# EAGLE design ai_breakout_LSM9DS0 (EAGLE 6.5.0)
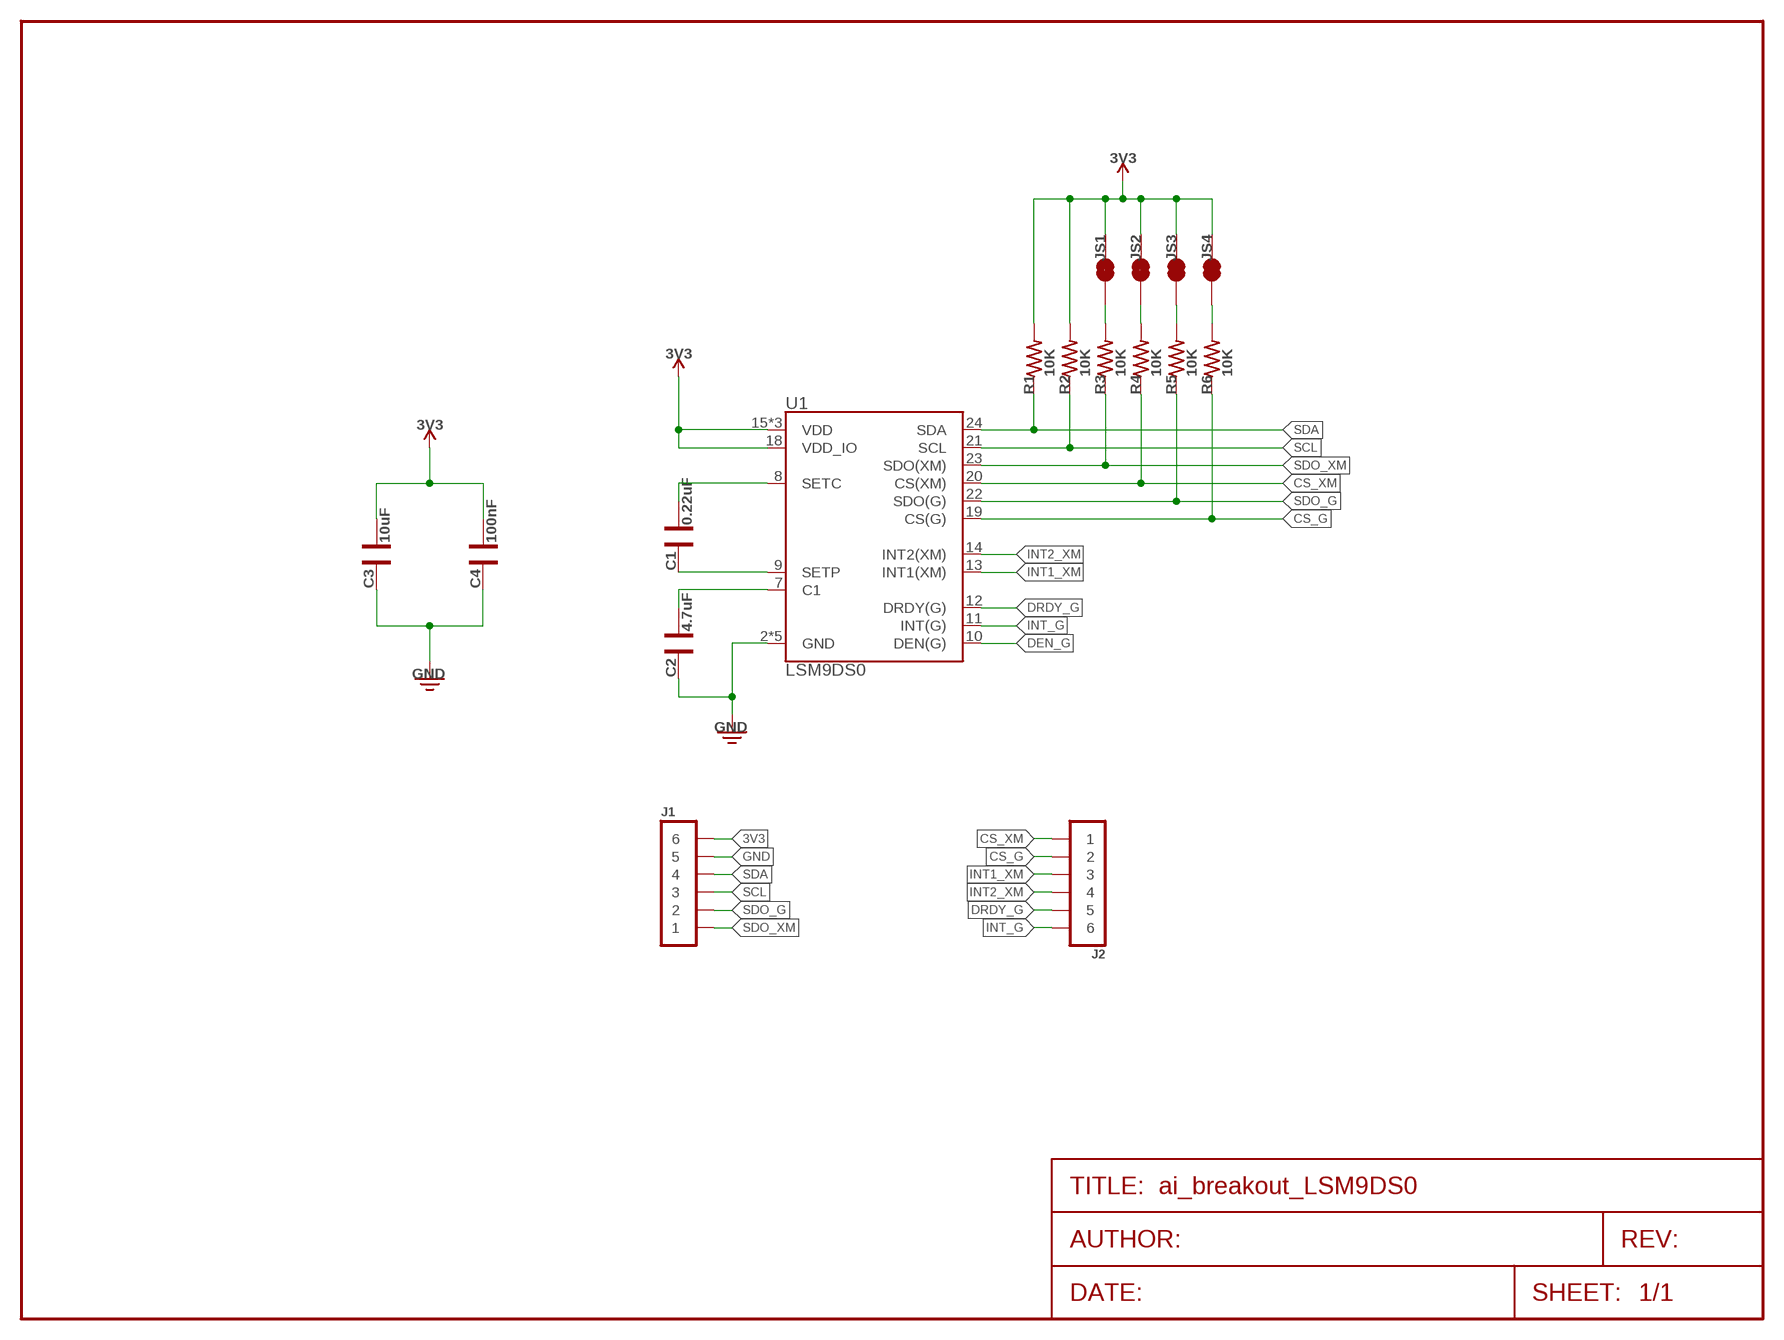
[diagram p0: schematic, sheet 1]

## Parts
C1  0.22uF  CAP0603  [CAP-0603]
C2  4.7uF  CAP0603  [CAP-0603]
C3  10uF  CAP0603  [CAP-0603]
C4  100nF  CAP0603  [CAP-0603]
J1  1X06  [1X06]
J2  1X06  [1X06]
JS1  1X02-SJ-NCT  [1X02-SJ-NCT]
JS2  1X02-SJ-NCT  [1X02-SJ-NCT]
JS3  1X02-SJ-NCT  [1X02-SJ-NCT]
JS4  1X02-SJ-NCT  [1X02-SJ-NCT]
R1  10K  RES0603  [RES-0603]
R2  10K  RES0603  [RES-0603]
R3  10K  RES0603  [RES-0603]
R4  10K  RES0603  [RES-0603]
R5  10K  RES0603  [RES-0603]
R6  10K  RES0603  [RES-0603]
U1  LSM9DS0  [LGA-24]

## Nets
3V3: C3.1 C4.1 J1.6 JS1.2 JS2.2 JS3.2 JS4.2 R1.2 R2.2 U1.15(VDD) U1.16(VDD) U1.17(VDD) U1.18(VDD_IO)
CS_G: J2.2 R6.1 U1.19(CS(G))
CS_XM: J2.1 R4.1 U1.20(CS(XM))
DEN_G: U1.10(DEN(G))
DRDY_G: J2.5 U1.12(DRDY(G))
GND: C2.2 C3.2 C4.2 J1.5 U1.2(GND) U1.3(GND) U1.4(GND) U1.5(GND) U1.6(GND)
INT1_XM: J2.3 U1.13(INT1(XM))
INT2_XM: J2.4 U1.14(INT2(XM))
INT_G: J2.6 U1.11(INT(G))
N$1: C1.1 U1.8(SETC)
N$2: C1.2 U1.9(SETP)
N$3: C2.1 U1.7(C1)
N$10: JS1.1 R3.2
N$11: JS2.1 R4.2
N$12: JS3.1 R5.2
N$13: JS4.1 R6.2
SCL: J1.3 R2.1 U1.21(SCL)
SDA: J1.4 R1.1 U1.24(SDA)
SDO_G: J1.2 R5.1 U1.22(SDO(G))
SDO_XM: J1.1 R3.1 U1.23(SDO(XM))

## Library data of the parts
C1-C4 = Ai_Passives:CAP
J1 J2 = Ai_Connectors:1X06
JS1-JS4 = Ai_Connectors:1X02-SJ-NC: Solder Jumper Normally closed versions.
R1-R6 = Ai_Passives:RES: Part # blah Digikey
U1 = SparkFun-DigitalIC:LSM9DS0: LSM9DS0 3D Accelerometer, 3D Gyroscope, 3D Magnetomter Features: 3 acceleration channels, 3 angular rate channels, 3 magnetic field channels ±2/±4/±6/±8/±16 g linear acceleration full scale ±2/±4/±8/±12 gauss magnetic full scale ±245/±500/±2000 dps angular rate full scale 16-bit data output SPI / I2C serial interfaces Analog supply voltage 2.4 V to 3.6 V Power-down mode / low-power mode Programmable interrupt generators Embedded self-test Embedded temperature sensor Embedded FIFO Position and motion detection functions Click/double-click recognition

## Net classes
0 default: width 0.203 mm, drill 0.381 mm, clearance 0.152 mm

## Board
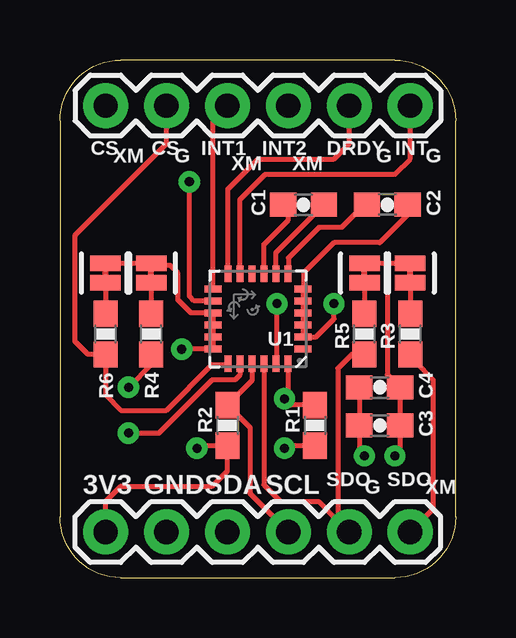
[diagram p1: board, top side]
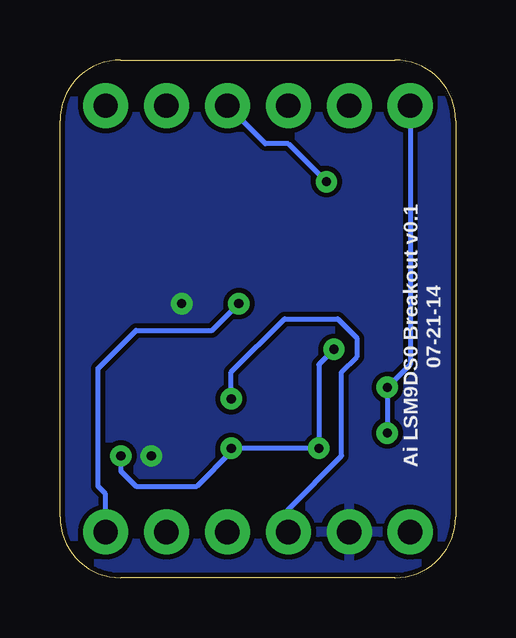
[diagram p2: board, bottom side, seen from below]

Size 16.51 x 21.59 mm. Coordinates in mm from the lower left corner, seen from the top.
Outline: 2.54,0 13.97,0 arc90 16.51,2.54 16.51,19.05 arc90 13.97,21.59 2.54,21.59 arc90 0,19.05 0,2.54 arc90 2.54,0
Copper layers (1*16): Top 0.035mm / dielectric 1.5mm / Bottom 0.035mm
Design rules "ai_2layer": minimum track width 7mil, minimum drill 15mil, track to track 8mil, track to pad 8mil, pad to pad 8mil, via to via 8mil, smd to smd 8mil, copper to edge 8mil, drill to drill 8mil, minimum pad ring 12mil, minimum via ring 10mil, stop-mask expansion 4mil, vias tented up to drill 20mil, thermal gap 10mil

### Footprints (pad centres in the part's own frame; a part is rotated, then mirrored left to right if it is on the bottom)
CAP-0603 = smd 1.1 x 1: 1 -0.85,0; 2 0.85,0
1X06 = drill 1.016 pad 1.88: 1 -6.35,0; 2 -3.81,0; 3 -1.27,0; 4 1.27,0; 5 3.81,0; 6 6.35,0
1X02-SJ-NCT = smd 0.635 x 1.27: 1 -0.401,0; 2 0.413,0
RES-0603 = smd 1.1 x 1: 1 -0.85,0; 2 0.85,0
LGA-24 = smd 0.7 x 0.29: 1 -1.875,1.25; 2 -1.875,0.75; 3 -1.875,0.25; 4 -1.875,-0.25; 5 -1.875,-0.75; 6 -1.875,-1.25; 13 1.875,-1.25; 14 1.875,-0.75; 15 1.875,-0.25; 16 1.875,0.25; 17 1.875,0.75; 18 1.875,1.25 | smd 0.29 x 0.7: 7 -1.25,-1.875; 8 -0.75,-1.875; 9 -0.25,-1.875; 10 0.25,-1.875; 11 0.75,-1.875; 12 1.25,-1.875; 19 1.25,1.875; 20 0.75,1.875; 21 0.25,1.875; 22 -0.25,1.875; 23 -0.75,1.875; 24 -1.25,1.875

### Placement (x,y rotation side)
C1  10.16,15.56 180 top
C2  13.65,15.56 0 top
C3  13.34,6.35 180 top
C4  13.34,7.94 180 top
J1  8.26,1.91 180 top
J2  8.26,19.68 0 top
JS1  14.61,12.7 90 top
JS2  3.81,12.7 90 top
JS3  12.7,12.7 90 top
JS4  1.91,12.7 90 top
R1  10.64,6.35 270 top
R2  6.99,6.35 270 top
R3  14.61,10.16 90 top
R4  3.81,10.16 90 top
R5  12.7,10.16 90 top
R6  1.91,10.16 90 top
U1  8.26,10.79 180 top

### Tracks (layer width: path | path; a pad name or v marks a point on that pad's centre or on a via)
3V3  (via drill 0.38)
  Top 0.203: JS3.2 13.65,13.11 | 13.65,13.11 JS1.2 | JS4.2 JS2.2 3.9,13.02 4.6,13.02 4.92,12.7 4.92,11.59 5.46,11.04 U1.15 U1.16 U1.17 U1.18 5.1,9.54 v5.08,9.53 | C4.1 14.19,8.04 | J1.6 1.91,3.17 2.54,3.81 6.35,3.81 6.99,4.45 R2.2 5.82,5.5 v5.71,5.4 | C4.1 C3.1 14.19,5.29 v13.97,5.08 | 13.65,13.11 13.65,8.47 C4.1 | R1.2 9.47,5.5 v9.37,5.4
  Bottom 0.203: v5.08,9.53 5.71,8.89 v5.71,5.4 v9.37,5.4 9.37,5.24 10.79,3.81 13.34,3.81 13.97,4.45 v13.97,5.08
CS_G
  Top 0.203: J2.2 4.45,18.1 0.64,14.29 0.64,9.84 1.17,9.31 R6.1 1.91,7.62 2.54,6.99 4.45,6.99 6.35,8.89 6.97,8.89 U1.19
CS_XM  (via drill 0.38)
  Top 0.203: U1.20 7.5,8.46 7.3,8.26 6.35,8.26 4.13,6.03 v2.86,6.03 | R4.1 3.81,8.89 v2.86,7.94
  Bottom 0.203: J2.1 1.91,8.89 v2.86,7.94 v2.86,6.03
DRDY_G
  Top 0.203: U1.12 7,16.21 8.26,17.46 11.43,17.46 12.06,18.1 J2.5
GND  (via drill 0.38)
  Top 0.203: C2.2 14.5,15.14 13.34,13.97 11.43,13.97 10.16,12.7 10.16,12.07 U1.6 U1.5 U1.4 U1.3 U1.2 10.68,10.04 11.43,10.79 v11.43,11.43 | 12.48,7.83 C4.2 C3.2 12.48,5.29 v12.7,5.08
  pour Bottom: 0,21.59 0,0 16.51,0 16.51,21.59
INT1_XM
  Top 0.203: U1.13 6.38,19.08 J2.3
INT2_XM  (via drill 0.38)
  Top 0.203: U1.14 5.6,11.54 5.4,11.75 v5.4,16.51
  Bottom 0.203: J2.4 7.94,18.1 6.99,18.1 v5.4,16.51
INT_G
  Top 0.203: U1.11 7.5,15.76 8.57,16.83 13.97,16.83 14.61,17.46 J2.6
N$1
  Top 0.203: U1.8 9.01,13.55 C1.1
N$2
  Top 0.203: U1.9 8.51,13.9 9.53,14.92 9.53,15.34 C1.2
N$3
  Top 0.203: C2.1 12.7,15.56 11.75,14.61 10.79,14.61 9.53,13.34 9.53,12.69 U1.7
N$10
  Top 0.203: JS1.1 R3.2
N$11
  Top 0.203: JS2.1 R4.2
N$12
  Top 0.203: JS3.1 R5.2
N$13
  Top 0.203: JS4.1 R6.2
SCL
  Top 0.203: U1.21 8.01,8.22 R2.1 7.94,6.25 7.94,3.49 J1.3
SDA  (via drill 0.38)
  Top 0.203: 10.79,7.14 R1.1 9.63,7.2 v9.37,7.46 9.51,7.6 U1.24
  Bottom 0.203: J1.4 6.99,2.86 4.76,5.08 4.76,8.57 4.13,9.21 4.13,10 4.92,10.79 7.14,10.79 9.37,8.57 v9.37,7.46
SDO_G
  Top 0.203: 11.59,2.38 10.79,3.17 9.21,3.17 8.51,3.88 U1.22 | R5.1 12.17,9.31 11.59,8.73 11.59,2.38 | 11.59,2.38 J1.2
SDO_XM  (via drill 0.38)
  Top 0.203: R3.1 14.82,9.31 14.82,8.99 15.56,8.26 15.56,2.86 J1.1 | U1.23 9.05,8.96 v9.05,11.43
  Bottom 0.203: J1.1 14.61,3.49 14.92,3.81 14.92,8.73 13.34,10.32 10.16,10.32 v9.05,11.43

### Text on the board
tPlace: CS | CS | INT1 | INT2 | DRDY | INT | XM | G | XM | XM | G | G | SDO | SDO | 3V3 | GND | SDA | SCL | G | XM
bPlace: 07-21-14 | Ai LSM9DS0 Breakout v0.1